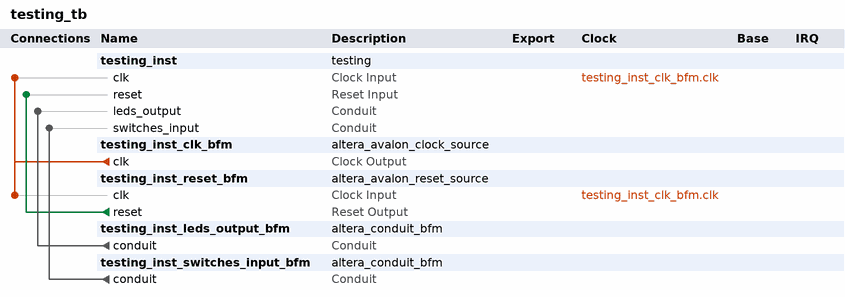
[diagram p0: system contents]
# Platform Designer (Qsys) system testing_tb, Cyclone IV E EP4CE22F17C6
# Parameters at their usual value, and those the tool derives, are not listed.
package require -exact qsys 13.1
create_system testing_tb
set_project_property DEVICE_FAMILY {Cyclone IV E}
set_project_property DEVICE EP4CE22F17C6

add_instance testing_inst testing 1.0

add_instance testing_inst_clk_bfm altera_avalon_clock_source 13.1

add_instance testing_inst_reset_bfm altera_avalon_reset_source 13.1
set_instance_parameter_value testing_inst_reset_bfm ASSERT_HIGH_RESET 0
set_instance_parameter_value testing_inst_reset_bfm INITIAL_RESET_CYCLES 50

add_instance testing_inst_leds_output_bfm altera_conduit_bfm 13.1
set_instance_parameter_value testing_inst_leds_output_bfm CLOCKED_SIGNAL false
set_instance_parameter_value testing_inst_leds_output_bfm ENABLE_RESET false
set_instance_parameter_value testing_inst_leds_output_bfm SIGNAL_WIDTHS 8
set_instance_parameter_value testing_inst_leds_output_bfm SIGNAL_DIRECTIONS input

add_instance testing_inst_switches_input_bfm altera_conduit_bfm 13.1
set_instance_parameter_value testing_inst_switches_input_bfm CLOCKED_SIGNAL false
set_instance_parameter_value testing_inst_switches_input_bfm ENABLE_RESET false
set_instance_parameter_value testing_inst_switches_input_bfm SIGNAL_WIDTHS 8
set_instance_parameter_value testing_inst_switches_input_bfm SIGNAL_DIRECTIONS output

# connections
add_connection testing_inst_clk_bfm.clk testing_inst.clk clock
add_connection testing_inst_clk_bfm.clk testing_inst_reset_bfm.clk clock
add_connection testing_inst_reset_bfm.reset testing_inst.reset reset
add_connection testing_inst_leds_output_bfm.conduit testing_inst.leds_output conduit
add_connection testing_inst_switches_input_bfm.conduit testing_inst.switches_input conduit

set_interconnect_requirement {$system} qsys_mm.clockCrossingAdapter HANDSHAKE
set_interconnect_requirement {$system} qsys_mm.maxAdditionalLatency 1
set_interconnect_requirement {$system} qsys_mm.insertDefaultSlave false

save_system testing_tb.qsys
